# EAGLE design 4017Divider (EAGLE 8.7.0)
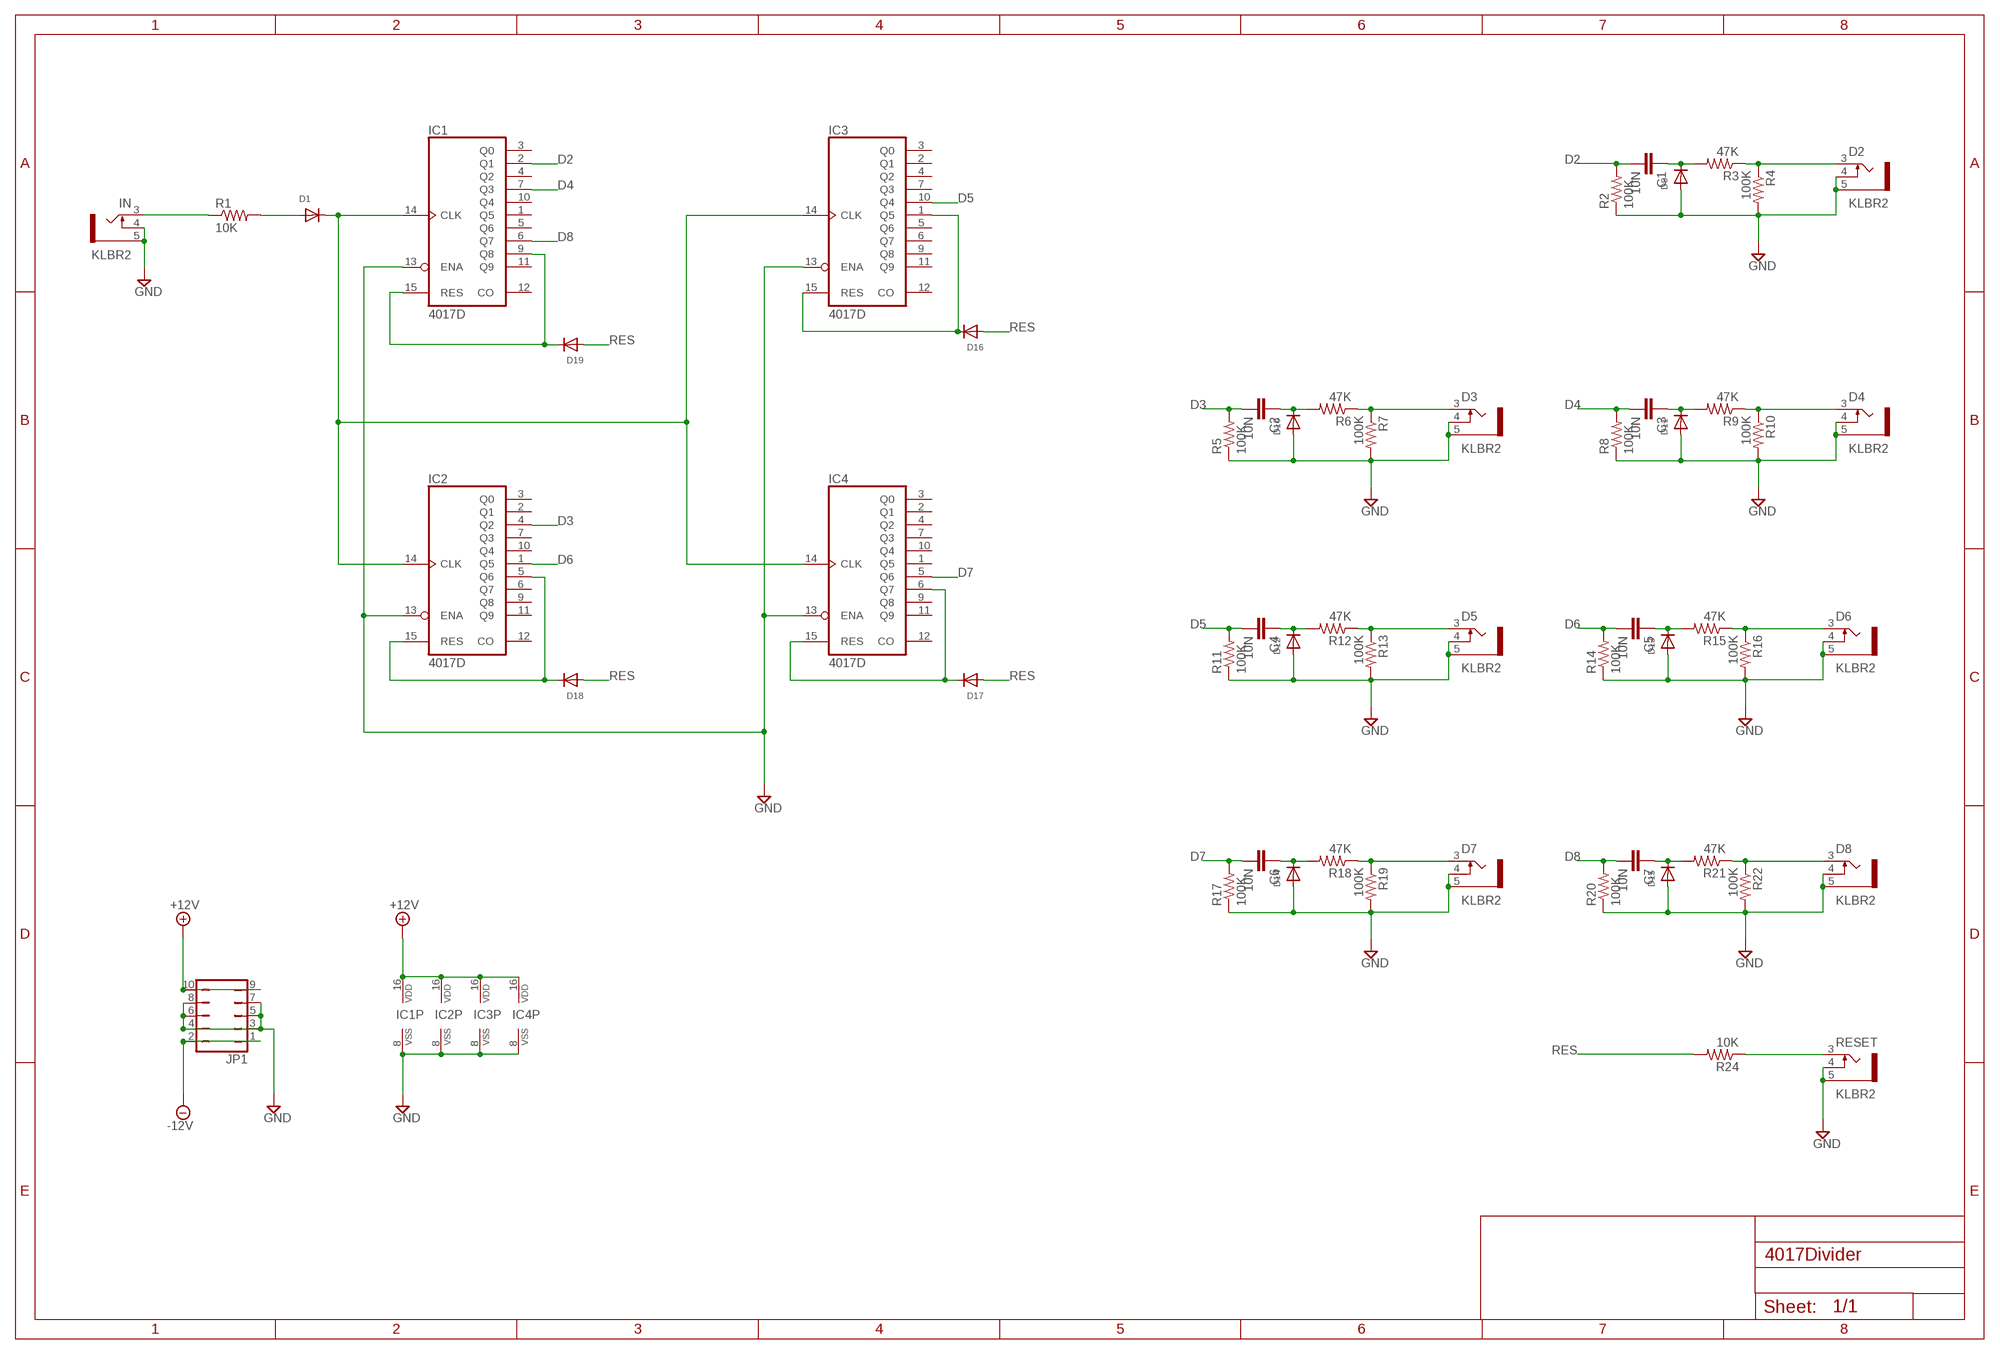
[diagram p0: schematic, sheet 1]

## Parts
C1  10N  C-EUC0603K  [C0603K]
C2  10N  C-EUC0603K  [C0603K]
C3  10N  C-EUC0603K  [C0603K]
C4  10N  C-EUC0603K  [C0603K]
C5  10N  C-EUC0603K  [C0603K]
C6  10N  C-EUC0603K  [C0603K]
C7  10N  C-EUC0603K  [C0603K]
D1  DIODESOD-123  [SOD-123]
D2  KLBR2  [KLBR2]
D3  KLBR2  [KLBR2]
D4  KLBR2  [KLBR2]
D5  KLBR2  [KLBR2]
D6  KLBR2  [KLBR2]
D7  KLBR2  [KLBR2]
D8  KLBR2  [KLBR2]
D9  DIODESOD-123  [SOD-123]
D10  DIODESOD-123  [SOD-123]
D11  DIODESOD-123  [SOD-123]
D12  DIODESOD-123  [SOD-123]
D13  DIODESOD-123  [SOD-123]
D14  DIODESOD-123  [SOD-123]
D15  DIODESOD-123  [SOD-123]
D16  DIODESOD-123  [SOD-123]
D17  DIODESOD-123  [SOD-123]
D18  DIODESOD-123  [SOD-123]
D19  DIODESOD-123  [SOD-123]
IC1  4017D  [SO16]
IC2  4017D  [SO16]
IC3  4017D  [SO16]
IC4  4017D  [SO16]
IN  KLBR2  [KLBR2]
JP1  JP5Q  [JP5Q]
R1  10K  R-US_R0603  [R0603]
R2  100K  R-US_R0603  [R0603]
R3  47K  R-US_R0603  [R0603]
R4  100K  R-US_R0603  [R0603]
R5  100K  R-US_R0603  [R0603]
R6  47K  R-US_R0603  [R0603]
R7  100K  R-US_R0603  [R0603]
R8  100K  R-US_R0603  [R0603]
R9  47K  R-US_R0603  [R0603]
R10  100K  R-US_R0603  [R0603]
R11  100K  R-US_R0603  [R0603]
R12  47K  R-US_R0603  [R0603]
R13  100K  R-US_R0603  [R0603]
R14  100K  R-US_R0603  [R0603]
R15  47K  R-US_R0603  [R0603]
R16  100K  R-US_R0603  [R0603]
R17  100K  R-US_R0603  [R0603]
R18  47K  R-US_R0603  [R0603]
R19  100K  R-US_R0603  [R0603]
R20  100K  R-US_R0603  [R0603]
R21  47K  R-US_R0603  [R0603]
R22  100K  R-US_R0603  [R0603]
R24  10K  R-US_R0603  [R0603]
RESET  KLBR2  [KLBR2]

## Nets
+12V: IC1.16(VDD) IC2.16(VDD) IC3.16(VDD) IC4.16(VDD) JP1.9 JP1.10
-12V: JP1.1 JP1.2
D2: C1.2 IC1.2(Q1) R2.2
D3: C2.2 IC2.4(Q2) R5.2
D4: C3.2 IC1.7(Q3) R8.2
D5: C4.2 IC3.10(Q4) R11.2
D6: C5.2 IC2.1(Q5) R14.2
D7: C6.2 IC4.5(Q6) R17.2
D8: C7.2 IC1.6(Q7) R20.2
GND: D2.4 D2.5 D3.4 D3.5 D4.4 D4.5 D5.4 D5.5 D6.4 D6.5 D7.4 D7.5 D8.4 D8.5 D9.A D10.A D11.A D12.A D13.A D14.A D15.A IC1.8(VSS) IC1.13(ENA) IC2.8(VSS) IC2.13(ENA) IC3.8(VSS) IC3.13(ENA) IC4.8(VSS) IC4.13(ENA) IN.4 IN.5 JP1.3 JP1.4 JP1.5 JP1.6 JP1.7 JP1.8 R2.1 R4.2 R5.1 R7.2 R8.1 R10.2 R11.1 R13.2 R14.1 R16.2 R17.1 R19.2 R20.1 R22.2 RESET.4 RESET.5
N$1: D1.A R1.2
N$2: D1.C IC1.14(CLK) IC2.14(CLK) IC3.14(CLK) IC4.14(CLK)
N$3: C2.1 D10.C R6.2
N$4: IN.3 R1.1
N$5: C1.1 D9.C R3.2
N$6: D2.3 R3.1 R4.1
N$7: D3.3 R6.1 R7.1
N$8: C4.1 D12.C R12.2
N$9: C3.1 D11.C R9.2
N$10: D4.3 R9.1 R10.1
N$11: D5.3 R12.1 R13.1
N$12: C5.1 D13.C R15.2
N$13: D6.3 R15.1 R16.1
N$14: C6.1 D14.C R18.2
N$15: D7.3 R18.1 R19.1
N$16: C7.1 D15.C R21.2
N$17: D8.3 R21.1 R22.1
N$18: D18.C IC2.5(Q6) IC2.15(RES)
N$19: R24.1 RESET.3
N$20: D17.C IC4.6(Q7) IC4.15(RES)
N$21: D19.C IC1.9(Q8) IC1.15(RES)
N$22: D16.C IC3.1(Q5) IC3.15(RES)
RES: D16.A D17.A D18.A D19.A R24.2
Unconnected: IC1.1(Q5) IC1.3(Q0) IC1.4(Q2) IC1.5(Q6) IC1.10(Q4) IC1.11(Q9) IC1.12(CO) IC2.2(Q1) IC2.3(Q0) IC2.6(Q7) IC2.7(Q3) IC2.9(Q8) IC2.10(Q4) IC2.11(Q9) IC2.12(CO) IC3.2(Q1) IC3.3(Q0) IC3.4(Q2) IC3.5(Q6) IC3.6(Q7) IC3.7(Q3) IC3.9(Q8) IC3.11(Q9) IC3.12(CO) IC4.1(Q5) IC4.2(Q1) IC4.3(Q0) IC4.4(Q2) IC4.7(Q3) IC4.9(Q8) IC4.10(Q4) IC4.11(Q9) IC4.12(CO)

## Library data of the parts
C1-C7 = rcl:C-EU: CAPACITOR, European symbol
D1 D9-D19 = adafruit:DIODE: Diode SMADIODE - SMA Surface Mount Package 20V 1A Schottky Diode Digikey: 641-1014-6-ND DO-1N4148 - Through Hole Small Current Diode SOD-123 20V 1 A (.5mV Vf) Schottky Diode - Digikey: MBRX120TPMSCT-ND SOD-323 10V 570mA (.38mV Vf, 3ns) Schottky Diode - Digikey: ZLLS410CT-ND SOD-523 30V 30mA Schottky Diode (RB751S-40TE61) - Digikey: RB751S-40TE61CT-ND SOT23-R/W - SOT23 Package (R = Solder Paste/Reflow Ovens, W = Hand-Soldering) BAT54Film 40V 300mA - Digikey: 497-7162-1-ND
D2-D8 IN RESET = con-lumberg:KLBR?: Jack connectors according to JISC 6560, 2.5mm / 3.5 mm Klinkensteckverbinder nach JISC 6560, 2.5mm / 3,5 mm Source: http://www.lumberg.com/Produkte/PDFs/KLBR2.pdf www.lumberg.com/Produkte/PDFs/KLBR1.pdf; OC_FARNELL: unknown; OC_NEWARK: unknown
IC1-IC4 = 40xx:4017: COUNTER/DIVIDER
JP1 = jumper:JP5Q: JUMPER
R1-R22 R24 = resistor:R-US_: RESISTOR, American symbol

## Board
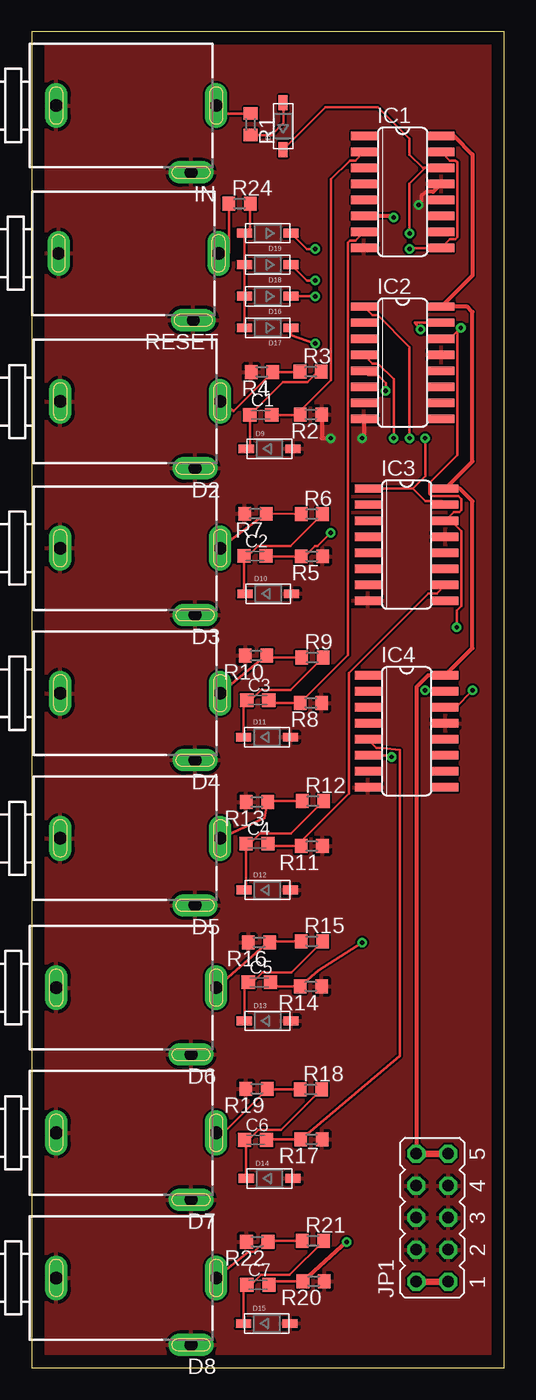
[diagram p1: board, top side]
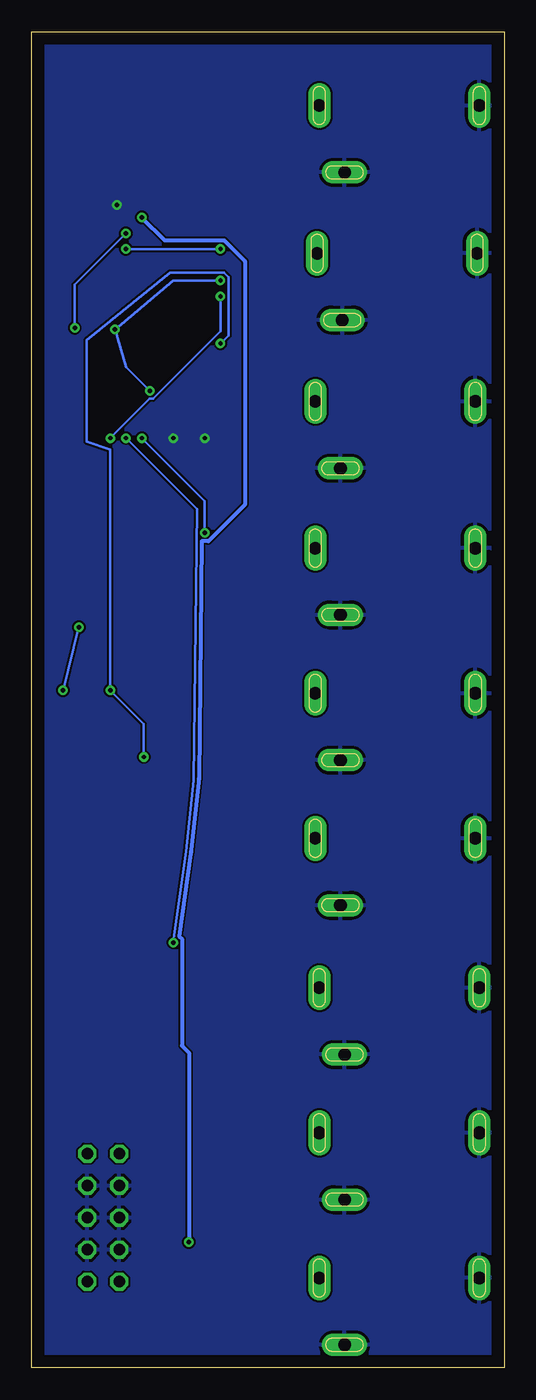
[diagram p2: board, bottom side, seen from below]

Size 37.5 x 106 mm. Coordinates in mm from the lower left corner, seen from the top.
Outline: 0,0 37.5,0 37.5,106 0,106 0,0
Copper layers (1*16): Top 0.035mm / dielectric 1.5mm / Bottom 0.035mm
Design rules "default": minimum track width 6mil, minimum drill 0.35mm, track to track 6mil, track to pad 6mil, pad to pad 6mil, via to via 6mil, smd to smd 6mil, copper to edge 40mil, drill to drill 6mil, minimum pad ring 10mil, minimum via ring 8mil, stop-mask expansion 4mil, vias tented up to drill 0mil, thermal gap 10mil

### Footprints (pad centres in the part's own frame; a part is rotated, then mirrored left to right if it is on the bottom)
C0603K = smd 1.05 x 1.08: 1 -0.875,0; 2 0.875,0
SOD-123 = smd 1.2 x 0.7: A 1.85,0; C -1.85,0
KLBR2 = drill 1 pad 1.8 long: 3 0,-6.35; 4 -5.3,-4.35; 5 0,6.35
SO16 = smd 0.66 x 2.032: 1 -4.445,-3.073; 2 -3.175,-3.073; 3 -1.905,-3.073; 4 -0.635,-3.073; 5 0.635,-3.073; 6 1.905,-3.073; 7 3.175,-3.073; 8 4.445,-3.073; 9 4.445,3.073; 10 3.175,3.073; 11 1.905,3.073; 12 0.635,3.073; 13 -0.635,3.073; 14 -1.905,3.073; 15 -3.175,3.073; 16 -4.445,3.073
JP5Q = drill 0.914 octagon: 1 -5.08,-1.27; 2 -5.08,1.27; 3 -2.54,-1.27; 4 -2.54,1.27; 5 0,-1.27; 6 0,1.27; 7 2.54,-1.27; 8 2.54,1.27; 9 5.08,-1.27; 10 5.08,1.27
R0603 = smd 1 x 1.1: 1 -0.85,0; 2 0.85,0

### Placement (x,y rotation side)
C1  18.2,75.59 0 top
C2  17.73,64.41 0 top
C3  17.95,52.97 0 top
C4  17.89,41.59 0 top
C5  18.09,30.59 0 top
C6  17.77,18.09 0 top
C7  17.96,6.59 0 top
D1  19.97,98.49 90 top
D2  8.63,76.66 90 top
D3  8.63,65.03 90 top
D4  8.63,53.52 90 top
D5  8.63,42.01 90 top
D6  8.31,30.16 90 top
D7  8.31,18.65 90 top
D8  8.31,7.14 90 top
D9  18.89,72.91 0 top
D10  18.79,61.41 0 top
D11  18.69,50.03 0 top
D12  18.71,37.91 0 top
D13  18.74,27.53 0 top
D14  18.89,15.03 0 top
D15  18.66,3.53 0 top
D16  18.75,85 180 top
D17  18.75,82.5 180 top
D18  18.75,87.5 180 top
D19  18.75,90 180 top
IC1  29.45,93.28 270 top
IC2  29.45,79.73 270 top
IC3  29.77,65.3 270 top
IC4  29.77,50.5 270 top
IN  8.31,100.13 90 top
JP1  31.8,11.92 90 top
R1  17.39,98.64 270 top
R2  22.18,75.62 180 top
R3  22.16,79.02 0 top
R4  18.28,79 180 top
R5  22.25,64.38 180 top
R6  22.24,67.72 0 top
R7  17.77,67.75 180 top
R8  22.17,52.75 180 top
R9  22.29,56.34 0 top
R10  17.82,56.5 180 top
R11  22.24,41.39 180 top
R12  22.33,44.97 0 top
R13  17.89,44.89 180 top
R14  22.16,30.27 180 top
R15  22.25,33.84 0 top
R16  18.07,33.77 180 top
R17  22.21,18.14 180 top
R18  22.17,22.09 0 top
R19  17.86,22.14 180 top
R20  22.39,6.89 180 top
R21  22.34,10.1 0 top
R22  17.91,10.02 180 top
R24  16.51,92.34 0 top
RESET  8.49,88.41 90 top

### Tracks (layer width: path | path; a pad name or v marks a point on that pad's centre or on a via)
+12V
  Top 0.305: IC1.16 33.52,97.72 35,96.25 35,86.65 IC2.16 34.58,84.17 35,83.75 35,71.9 IC3.16 34.01,69.75 35,68.75 35,57.1 IC4.16 31.48,54.95 30.57,54.03 30.57,53.47 30.57,53.46 30.57,17.04 JP1.10
  Top 0.508: JP1.9 JP1.10
-12V
  Top 0.508: JP1.2 JP1.1
D2
  Top 0.2: C1.2 21.3,75.59 R2.2 21.33,75.93 23.76,78.36 23.76,94.27 25.26,95.77 25.69,95.77 IC1.2
D3  (via drill 0.35)
  Top 0.2: C2.2 18.64,64.38 R5.2 21.69,64.38 22.49,65.18 22.68,65.18 v23.75,66.25 | IC2.4 27.06,79.68 27.5,79.68 28.75,78.42 v28.75,73.75
  Bottom 0.2: v28.75,73.75 23.75,68.75 v23.75,66.25
D4
  Top 0.2: C3.2 19.05,52.75 R8.2 25.11,56.54 25.11,89.27 25.26,89.42 25.69,89.42 IC1.7
D5
  Top 0.2: C4.2 18.98,41.39 R11.2 21.39,41.77 25.18,45.56 25.18,55.13 31.49,61.44 32.16,61.44 IC3.10
D6  (via drill 0.35)
  Top 0.2: C5.2 19.29,30.27 R14.2 22.77,31.52 v26.25,33.75 | IC2.1 27.06,83.49 27.5,83.49 30,80.98 v30,73.75
  Bottom 0.2: v26.25,33.75 25.25,40.98 24.63,46.61 24.38,68.13 v30,73.75
D7
  Top 0.2: C6.2 18.7,18.14 R17.2 29.21,24.74 29.21,49.03 27.82,49.18 27.38,49.18 IC4.5
D8  (via drill 0.35)
  Top 0.2: C7.2 19.14,6.89 R20.2 21.83,6.89
  Top 0.305: IC1.6 28.62,91.38 v28.75,91.25 | v25,10 R20.2
  Bottom 0.305: v28.75,91.25 26.93,89.43 22.22,89.43 20.57,87.78 20.57,68.47 23.47,65.57 23.99,65.57 24.21,46.74 24.23,46.59 24.23,46.44 24.24,46.43 24.83,41.09 24.85,40.93 24.87,40.77 25.77,34.24 25.57,34.03 25.57,25.57 25,25 v25,10
GND  (via drill 0.35)
  Top 0.305: IC1.13 31.89,93.28 31.38,93.28 30.95,92.98 30.95,92.6 v30.73,92.25 | R2.1 23.03,73.75 v23.75,73.75 | IC2.8 26.38,73.75 v26.25,73.75
  pour Bottom: 0,106.25 37.5,106.25 37.5,0 0,0
  pour Top: 0,106.25 37.5,106.25 37.5,0 0,0
N$1
  Top 0.2: R1.2 19.04,97.79 20,98.75 20,100.31 D1.A
N$2  (via drill 0.35)
  Top 0.2: 31.25,95.19 31.07,95.19 30,96.25 30,97.5 27.5,100 23.33,100 D1.C | 31.25,95.19 IC1.14 | 31.25,95.19 30,93.94 v30,90 | IC2.14 33.2,81.64 v34.07,82.5 33.79,82.22 33.79,72.4 31.57,70.18 31.57,69.31 31.72,69.16 33.86,69.16 34.11,68.91 34.11,68.04 33.96,67.89 33.53,67.89 IC3.14 33.28,67.2 34.11,66.37 34.11,60.42 33.75,60.06 v33.75,58.75 | v35,53.75 33.66,52.41 IC4.14
  Bottom 0.2: v30,90 34.07,85.93 v34.07,82.5 | v33.75,58.75 v35,53.75
N$3
  Top 0.2: R6.2 20.57,65.2 17.98,65.2 17.19,64.41 C2.1 16.86,61.48 D10.C
N$4
  Top 0.2: IN.3 15.27,99.49 R1.1
N$5
  Top 0.2: R3.2 22.71,79.02 21.91,78.21 19.94,78.21 C1.1 17.32,73.19 D9.C
N$6
  Top 0.2: D2.3 16.04,75.91 R4.1 21.29,79 R3.1
N$7
  Top 0.2: D3.3 R7.1 R6.1
N$8
  Top 0.2: R12.2 20.6,42.39 18.14,42.39 17.35,41.59 C4.1 17.02,38.06 D12.C
N$9
  Top 0.2: R9.2 20.55,53.76 18.2,53.76 17.41,52.97 C3.1 16.84,52.73 D11.C
N$10
  Top 0.2: D4.3 18.59,56.5 R10.1 18.82,56.34 R9.1
N$11
  Top 0.2: D5.3 18.49,43.64 R13.1 18.82,44.97 R12.1
N$12
  Top 0.2: R15.2 20.64,31.39 18.33,31.39 17.54,30.59 C5.1 16.89,30.27 D13.C
N$13
  Top 0.2: D6.3 18.77,33.77 R16.1 19,33.84 R15.1
N$14
  Top 0.2: R18.2 19.81,18.89 18.02,18.89 17.23,18.09 C6.1 17.04,17.95 D14.C
N$15
  Top 0.2: D7.3 14.72,18.15 R19.1 18.76,22.09 R18.1
N$16
  Top 0.2: R21.2 20.48,7.39 18.21,7.39 17.42,6.59 C7.1 16.82,6.32 D15.C
N$17
  Top 0.2: D8.3 17.23,9.21 17.67,9.21 18.47,10.02 R22.1 18.84,10.1 R21.1
N$18  (via drill 0.35)
  Top 0.2: IC2.15 30.41,82.91 v30.88,82.38 | v28.12,77.5 28.12,78.13 27.5,78.75 26.72,78.75 IC2.5 | D18.C 21.85,86.25 v22.5,86.25
  Bottom 0.2: v28.12,77.5 30,79.38 v30.88,82.38 26.25,86.25 v22.5,86.25
N$19
  Top 0.2: RESET.3 15.66,88.48 R24.1
N$20  (via drill 0.35)
  Top 0.2: IC4.6 28.45,48.59 v28.58,48.46 | v31.25,53.75 32.77,53.75 IC4.15 | D17.C 20.6,81.9 v22.5,81.25
  Bottom 0.2: v28.58,48.46 28.58,51.08 v31.25,53.75 31.25,72.86 33.13,73.49 33.13,81.51 26.51,86.88 22.24,86.88 21.87,86.51 21.87,81.87 v22.5,81.25
N$21  (via drill 0.35)
  Top 0.2: IC1.15 33.21,95.77 33.64,95.77 33.79,95.62 33.79,89.67 33.64,89.52 33.21,89.52 IC1.9 30.09,88.83 v30,88.75 | D19.C 21.85,88.75 v22.5,88.75
  Bottom 0.2: v22.5,88.75 v30,88.75
N$22  (via drill 0.35)
  Top 0.2: 30.25,69.75 IC3.1 | 30.25,69.75 31.25,68.75 32.57,68.75 IC3.15 | D16.C v22.5,85 | v31.25,73.75 31.25,70.74 30.25,69.75
  Bottom 0.2: v31.25,73.75 28.13,76.87 27.86,76.87 22.5,82.23 v22.5,85
RES
  Top 0.2: R24.2 17.36,90.46 D19.A D18.A D16.A D17.A